# Altium schematic sheet logic.SchDoc
size A4; SheetNumber: 4; SheetTotal: 6
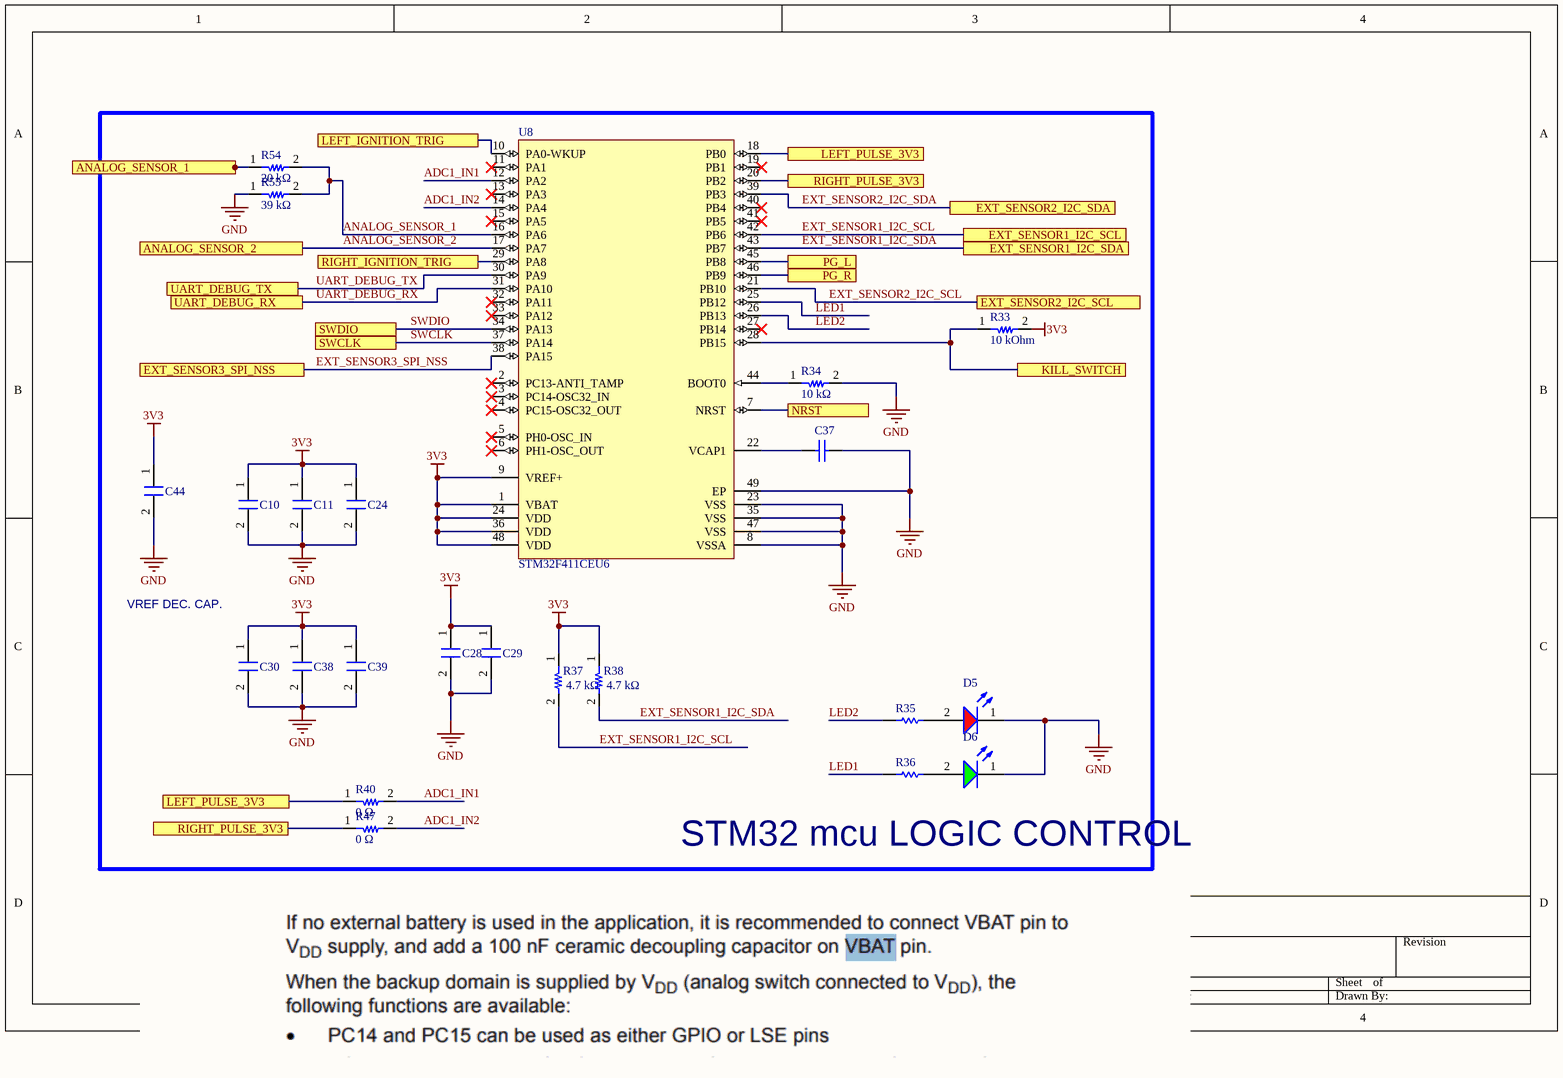
[diagram p0: logic.SchDoc]

## Parts
C10  Capacitor_0402  [0402_fp]  (value not drawn)
C11  Capacitor_0402  [0402_fp]  (value not drawn)
C24  Capacitor_0402  [0402_fp]  (value not drawn)
C28  Capacitor_0402  [0402_fp]  (value not drawn)
C29  Capacitor_0402  [0402_fp]  (value not drawn)
C30  Capacitor_0402  [0402_fp]  (value not drawn)
C37  0603ZD475MAT2A  [CAPC1608X90X35NL15T15]  (value not drawn)
C38  Capacitor_0402  [0402_fp]  (value not drawn)
C39  Capacitor_0402  [0402_fp]  (value not drawn)
C44  Capacitor_0402  [0402_fp]  (value not drawn)
D5  150080RS75000  [WL-SMCW_0805_150080xx75000]  (value not drawn)
D6  150080GS75000  [WL-SMCW_0805_150080xx75000]  (value not drawn)
R33  value 10 kOhm  [0603_FP]  (hidden comment: Resistor_0603)
R34  value 10 kΩ  [0402_fp]  (hidden comment: Resistor_0402)
R35  MCS04020D5600BE100  [RESC1005X37X20NL05T10]  (value not drawn)
R36  MCS04020D5600BE100  [RESC1005X37X20NL05T10]  (value not drawn)
R37  value 4.7 kΩ  [0402_fp]  (hidden comment: Resistor_0402)
R38  value 4.7 kΩ  [0402_fp]  (hidden comment: Resistor_0402)
R40  value 0 Ω  [0402_fp]  (hidden comment: Resistor_0402)
R47  value 0 Ω  [0402_fp]  (hidden comment: Resistor_0402)
R54  value 20 kΩ  [0402_fp]  (hidden comment: Resistor_0402)
R55  value 39 kΩ  [0402_fp]  (hidden comment: Resistor_0402)
U8  STM32F411CEU6  [STM-UFQFPN48_L]

## Ports
ANALOG_SENSOR_1 (see input_output[3B]), ANALOG_SENSOR_2, EXT_SENSOR1_I2C_SCL (see input_output[3C]), EXT_SENSOR1_I2C_SDA (see input_output[3C]), EXT_SENSOR2_I2C_SCL, EXT_SENSOR2_I2C_SDA, EXT_SENSOR3_SPI_NSS, KILL_SWITCH (see input_output[4B]), LEFT_IGNITION_TRIG (see cd_switching[2B]), LEFT_PULSE_3V3 (see input_signal_conditioning[3B], logic[1D]), LEFT_PULSE_3V3 (see input_signal_conditioning[3B], logic[3A]), NRST (see input_output[1B]), PG_L (see HV_power[4B]), PG_R (see HV_power[4C]), RIGHT_IGNITION_TRIG (see cd_switching[2B]), RIGHT_PULSE_3V3 (see input_signal_conditioning[3C], logic[1D]), RIGHT_PULSE_3V3 (see input_signal_conditioning[3C], logic[3A]), SWCLK (see input_output[1A]), SWDIO (see input_output[1A]), UART_DEBUG_RX (see input_output[1C]), UART_DEBUG_TX (see input_output[1B])

## Nets
3V3: C10.1 C11.1 C24.1 C28.1 C29.1 C30.1 C38.1 C39.1 C44.1 R33.2 R37.1 R38.1 U8.1(VBAT) U8.9(VREF+) U8.24(VDD) U8.36(VDD) U8.48(VDD)
GND: C10.2 C11.2 C24.2 C28.2 C29.2 C30.2 C37.2 C38.2 C39.2 C44.2 D5.1(K) D6.1(K) R34.2 R55.1 U8.8(VSSA) U8.23(VSS) U8.35(VSS) U8.47(VSS) U8.49(EP)
ADC1_IN1: R40.2 U8.12(PA2)
ADC1_IN2: R47.2 U8.14(PA4)
ANALOG_SENSOR_1: R54.2 R55.2 U8.16(PA6)
ANALOG_SENSOR_1: R54.1 ; port ANALOG_SENSOR_1  [a separate net that carries the same name]
ANALOG_SENSOR_2: U8.17(PA7) ; port ANALOG_SENSOR_2
EXT_SENSOR1_I2C_SCL: R37.2 U8.42(PB6) ; port EXT_SENSOR1_I2C_SCL
EXT_SENSOR1_I2C_SDA: R38.2 U8.43(PB7) ; port EXT_SENSOR1_I2C_SDA
EXT_SENSOR2_I2C_SCL: U8.21(PB10) ; port EXT_SENSOR2_I2C_SCL
EXT_SENSOR2_I2C_SDA: U8.39(PB3) ; port EXT_SENSOR2_I2C_SDA
EXT_SENSOR3_SPI_NSS: U8.38(PA15) ; port EXT_SENSOR3_SPI_NSS
KILL_SWITCH: R33.1 U8.28(PB15) ; port KILL_SWITCH
LED1: R36.1 U8.25(PB12)
LED2: R35.1 U8.26(PB13)
LEFT_IGNITION_TRIG: U8.10(PA0-WKUP) ; port LEFT_IGNITION_TRIG
LEFT_PULSE_3V3: R40.1 U8.18(PB0) ; port LEFT_PULSE_3V3
NRST: U8.7(NRST) ; port NRST
PG_L: U8.45(PB8) ; port PG_L
PG_R: U8.46(PB9) ; port PG_R
RIGHT_IGNITION_TRIG: U8.29(PA8) ; port RIGHT_IGNITION_TRIG
RIGHT_PULSE_3V3: R47.1 U8.20(PB2) ; port RIGHT_PULSE_3V3
SWCLK: U8.37(PA14) ; port SWCLK
SWDIO: U8.34(PA13) ; port SWDIO
UART_DEBUG_RX: U8.31(PA10) ; port UART_DEBUG_RX
UART_DEBUG_TX: U8.30(PA9) ; port UART_DEBUG_TX
NetC37_1: C37.1 U8.22(VCAP1)
NetD5_2: D5.2(A) R35.2
NetD6_2: D6.2(A) R36.2
NetR34_1: R34.1 U8.44(BOOT0)

Not connected (* = marked no-connect by the designer): U8 2(PC13-ANTI_TAMP)* 3(PC14-OSC32_IN)* 4(PC15-OSC32_OUT)* 5(PH0-OSC_IN)* 6(PH1-OSC_OUT)* 11(PA1)* 13(PA3)* 15(PA5)* 19(PB1)* 27(PB14)* 32(PA11)* 33(PA12)* 40(PB4)* 41(PB5)*

## Notes on the sheet
- VREF DEC. CAP.
- STM32 mcu LOGIC CONTROL

## Library data of the parts
C10 C11 C24 C28-C30 C38 C39 = Capacitor_0402: Value: 10 nF; Format: 0402; Package: 0402
C37 = CMP-1035-02787-2: Manufacturer: AVX Interconnect / Elco; Part Number: 0603ZD475MAT2A
C44 = Capacitor_0402: Value: 100 nF; Format: 0402; Package: 0402
D5 = CMP-1426-00011-3: LED Uni-Color Red 630nm 2-Pin Chip 0805(2012Metric) T/R; Viewing Angle: 140°; Max Junction Temperature (Tj): 95°C; Power Dissipation: 72mW; Forward Current: 100mA; Forward Voltage: 2V; Wavelength: 625nm; Test Current: 20mA; Max Reverse Voltage (DC): 5V; Luminous Intensity: 150mcd; Lens Style: Clear, Rectangular; REACH SVHC: Unknown; Height: 700µm; Case Code (Metric): 2012; Peak Wavelength: 630nm; Length: 2mm; Width: 1.25mm; RoHS: Compliant; Packaging: Tape and Reel; Dominant Wavelength: 625nm; Color: Red; Case Code (Imperial): 0805; Min Operating Temperature: -40°C; Mount: Surface Mount; Max Operating Temperature: 85°C; Case/Package: 0805
D6 = CMP-1426-00007-3: WURTH ELEKTRONIK - 150080GS75000 - LED, Green, SMD, 0805, 30 mA, 3.2 V, 520 nm; Forward Voltage: 3.2V; Viewing Angle: 140°; Power Dissipation: 105mW; Peak Wavelength: 515nm; Max Reverse Voltage (DC): 5V; Luminous Intensity: 450mcd; Wavelength: 525nm; Max Junction Temperature (Tj): 95°C; Forward Current: 100mA; Test Current: 20mA; Lens Style: Clear, Rectangular; Length: 2mm; Case/Package: 0805; Case Code (Metric): 2012; Color: Green; Height: 700µm; Width: 1.25mm; Packaging: Tape and Reel; Mount: Surface Mount; REACH SVHC: Unknown; RoHS: Compliant; Min Operating Temperature: -40°C; Reverse Voltage: 5V; Max Operating Temperature: 85°C; Dominant Wavelength: 525nm; Case Code (Imperial): 0805
R33 = Resistor_0603: Format: 0402; Package: 0402
R35 R36 = CMP-2002-02518-1: Manufacturer: Vishay BCcomponents; Part Number: MCS04020D5600BE100
U8 = CMP-0243-00165-1: ARM Cortex-M4 32-bit MCU+FPU, 512 KB Flash, 128 KB RAM, 36 I/Os, 48-Pin UFQFPN, -40 to 85 degC, Tray; Operating Frequency(F) (Processor speed) (MHz): 100; FLASH Size (Prog) (kB): 512; Internal RAM Size (kB): 128; I/Os (High Current): 36; Supply Voltage(Vcc) min (V): 1.7; Package Reference: 48-Pin Ultra Thin Fine Pitch Quad Flat No-Lead, 7 x 7 x 0.6 mm Body, 0.5 mm Pitch, Exposed Pad; ComponentLink1Description: Manufacturer URL; ComponentLink1URL: http://www.st.com/; Packing: Tray; Package Description: UFQFPN48; Core: ARM Cortex-M4; ComponentLink2Description: Datasheet; ComponentLink2URL: http://www.st.com/st-web-ui/static/active/en/resource/technical/document/datasheet/DM00115249.pdf; DatasheetVersion: Rev. 6; Mounting Technology: Surface Mount
R34 R37 R38 R40 R47 R54 R55 = Resistor_0402: Package: 0402